# Altium schematic sheet BayPower.SchDoc
size A4
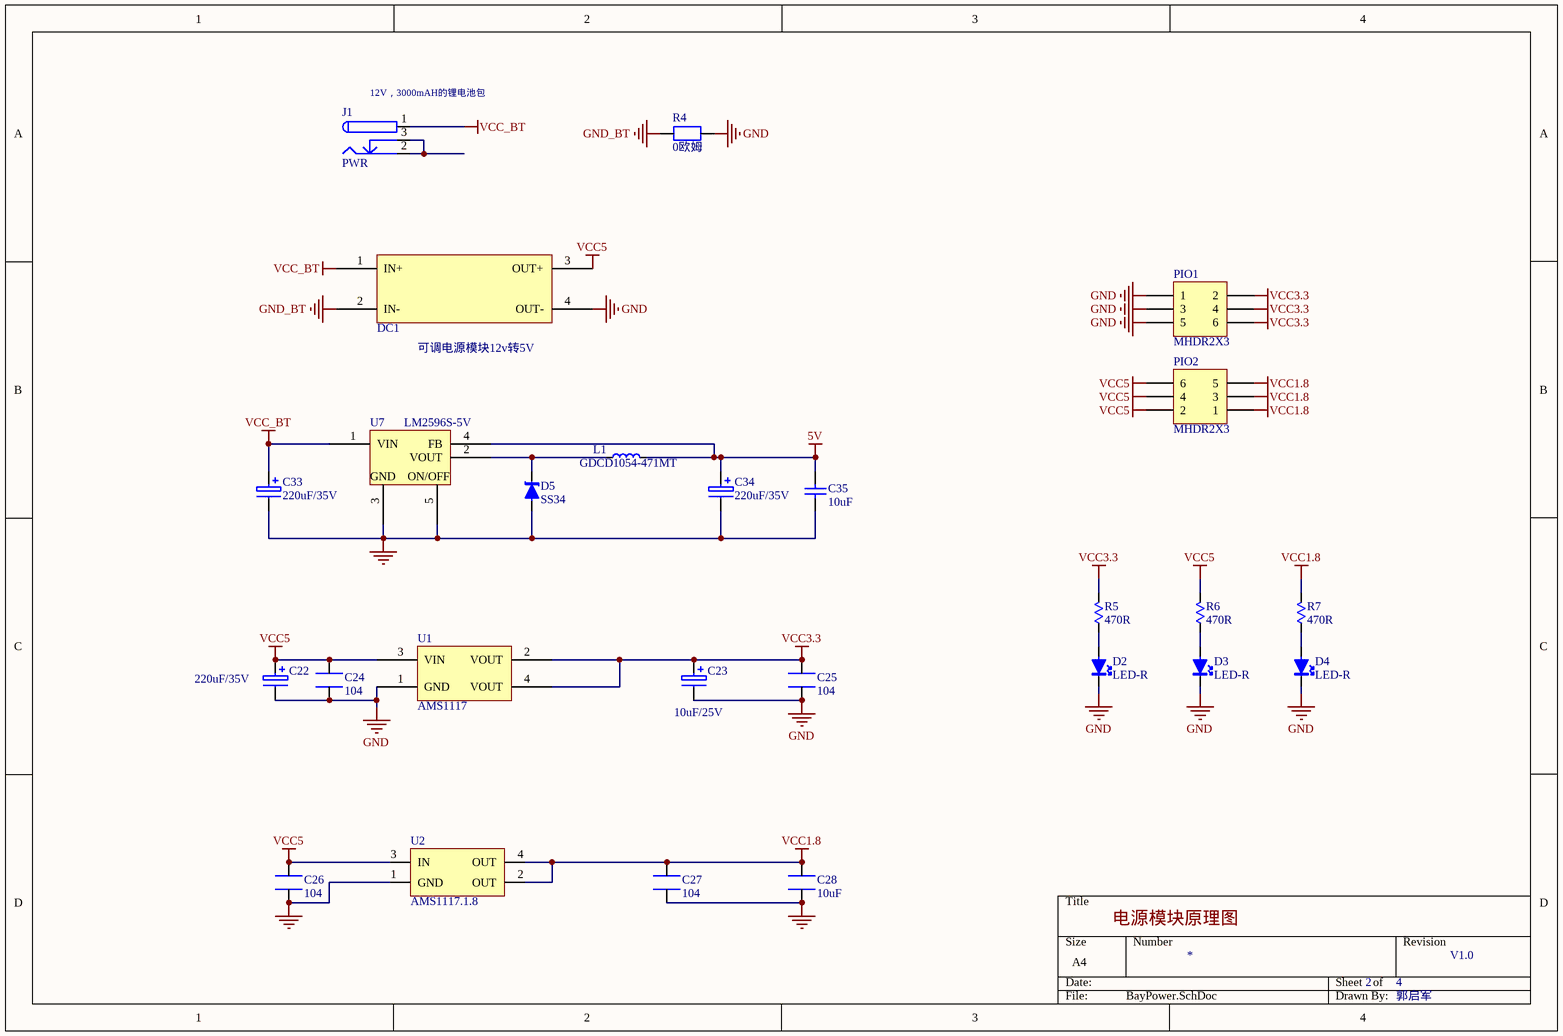
[diagram p0: BayPower.SchDoc]

## Parts
C22  220uF/35V  [CAPPR-8.3X8.3-SM-F]
C23  10uF/25V  [10UF/25v]
C24  104  [0805-bottom layer]
C25  104  [0805-bottom layer]
C26  104  [0805-bottom layer]
C27  104  [0805-bottom layer]
C28  10uF  [0805-bottom layer]
C33  220uF/35V  [CAPPR-8.3X8.3-SM-F]
C34  220uF/35V  [CAPPR-8.3X8.3-SM-F]
C35  10uF  [C0603-S]
D2  LED-R  [0805-bottom layer]
D3  LED-R  [0805-bottom layer]
D4  LED-R  [0805-bottom layer]
D5  SS34  [SMB]
DC1  LM2596S-ADJ  [DC-DC]  (value not drawn)
J1  PWR  [DC10B]
L1  GDCD1054-471MT  [GDCD1054]
PIO1  MHDR2X3  [HDR2X3]
PIO2  MHDR2X3  [HDR2X3]
R4  0欧姆  [0805-bottom layer]
R5  470R  [0805-bottom layer]
R6  470R  [0805-bottom layer]
R7  470R  [0805-bottom layer]
U1  AMS1117  [SOT-223]
U2  AMS1117.1.8  [SOT-223]
U7  LM2596S-5V  [D2PAK]

## Nets
5V: C34.1 C35.2 L1.2 U7.4(FB)
GND: C22.2 C23.2 C24.2 C25.2 C26.2 C27.2 C28.2 C33.2 C34.2 C35.1 D2.2(K) D3.2(K) D4.2(K) D5.1(A) DC1.4(OUT-) PIO1.1 PIO1.3 PIO1.5 R4.2 U1.1(GND) U2.1(GND) U7.3(GND) U7.5(ON/OFF)
GND_BT: DC1.2(IN-) R4.1
VCC1.8: C27.1 C28.1 PIO2.1 PIO2.3 PIO2.5 R7.1 U2.2(OUT) U2.4(OUT)
VCC3.3: C23.1 C25.1 PIO1.2 PIO1.4 PIO1.6 R5.1 U1.2(VOUT) U1.4(VOUT)
VCC5: C22.1 C24.1 C26.1 DC1.3(OUT+) PIO2.2 PIO2.4 PIO2.6 R6.1 U1.3(VIN) U2.3(IN)
VCC_BT: C33.1 DC1.1(IN+) J1.1 U7.1(VIN)
NetD2_1: D2.1(A) R5.2
NetD3_1: D3.1(A) R6.2
NetD4_1: D4.1(A) R7.2
NetD5_2: D5.2(K) L1.1 U7.2(VOUT)
NetJ1_2: J1.2 J1.3

## Notes on the sheet
- (near J1) 12V，3000mAH的锂电池包
- (near DC1) 可调电源模块12v转5V
- 电源模块原理图
- *
- 2
- 4
- V1.0
- 郭启军

## Library data of the parts
C22 C33 C34 = CAP-ELEC: Polarized Capacitor
C23 = CAP-ELEC_2: Polarized Capacitor
C24-C27 = 104: 电容
C28 = 10uF: 电容
C35 = CAP: Capacitor
D2-D4 = LED: Light Emitting Diode
D5 = DIODE-SBD: Schottky barrier rectifier
DC1 = LM2596S-ADJ: LM2596S-ADJ DC-DC电源模块
L1 = INDUCT: Inductor
PIO1 PIO2 = MHDR2X3: Header, 3-Pin, Dual row; LatestRevisionDate: 17-Jul-2002; LatestRevisionNote: Re-released for DXP Platform.; Publisher: Altium Limited
R4 = 1M: 电阻
R5-R7 = RES: Resistor
U1 = AMS1117: 800mA Low-Dropout Linear Regulator
U2 = AMS1117.1.8: 电压转换
U7 = LM2596